# Altium project PIC32ETH.PrjPcb (part 2 of 2)

## Sheet PIC32ETH_Usb.SchDoc: Usb
size A4; Date: 08.01.2022; DrawnBy: YS; DocumentNumber: n/a; Revision: v1.0.0; SheetNumber: 4; SheetTotal: 6; Project: PIC32ETH
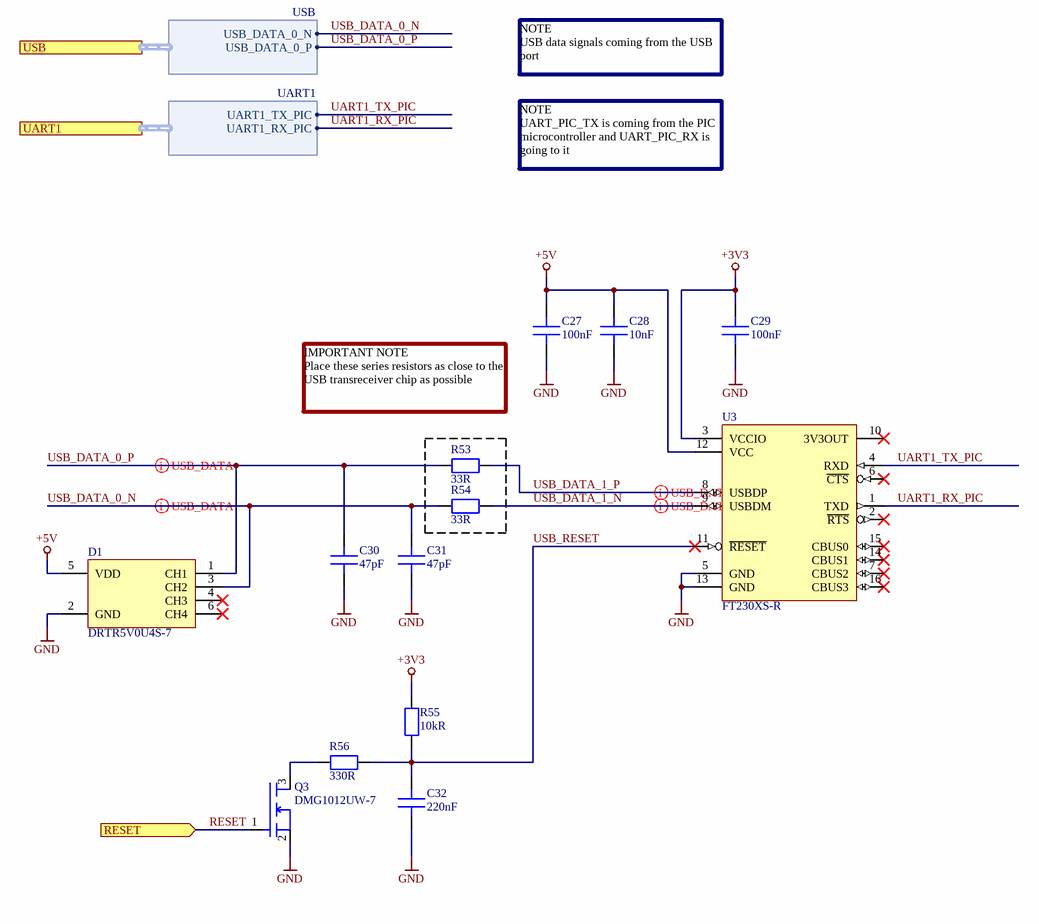
[diagram p6: PIC32ETH_Usb.SchDoc]

### Parts
C27  100nF  [C_CHIP2012N]
C28  10nF  [C_CHIP2012N]
C29  100nF  [C_CHIP2012N]
C30  47pF  [C_CHIP2012N]
C31  47pF  [C_CHIP2012N]
C32  220nF  [C_CHIP2012N]
D1  DRTR5V0U4S-7  [D_SOT65P210X100-6N]
Q3  DMG1012UW-7  [Q_SOT65P210X100-3N]
R53  33R  [R_CHIP2012N]
R54  33R  [R_CHIP2012N]
R55  10kR  [R_CHIP2012N]
R56  330R  [R_CHIP2012N]
U3  FT230XS-R  [U_TSOP64P600X135-16N]

### Ports
RESET (in), UART1 (harness UART1), USB (harness USB)

### Harnesses
USB: USB_DATA_0_P, USB_DATA_0_N
UART1: UART1_RX_PIC, UART1_TX_PIC

### Nets
+3V3: C29.1 R55.2 U3.3(VCCIO)
+5V: C27.1 C28.2 D1.5(VDD) U3.12(VCC)
GND: C27.2 C28.1 C29.2 C30.1 C31.1 C32.1 D1.2(GND) Q3.2(S) U3.5(GND) U3.13(GND)
RESET: Q3.1(G) ; port RESET
UART1_RX_PIC: U3.1(TXD) ; port UART1.UART1_RX_PIC
UART1_TX_PIC: U3.4(RXD) ; port UART1.UART1_TX_PIC
USB_DATA_0_N: C31.2 D1.3(CH2) R54.1 ; port USB.USB_DATA_0_N
USB_DATA_0_P: C30.2 D1.1(CH1) R53.1 ; port USB.USB_DATA_0_P
USB_DATA_1_N: R54.2 U3.9(USBDM)
USB_DATA_1_P: R53.2 U3.8(USBDP)
USB_RESET: C32.2 R55.1 R56.2 U3.11(~{RESET})
NetQ3_3: Q3.3(D) R56.1

Not connected (* = marked no-connect by the designer): D1 4(CH3)* 6(CH4)*; U3 2(~{RTS})* 6(~{CTS})* 7(CBUS2)* 10(3V3OUT)* 14(CBUS1)* 15(CBUS0)* 16(CBUS3)*

### Layout directives
differential pair; differential pair class USB_DATA: USB_DATA_0_N, USB_DATA_0_P, USB_DATA_1_N, USB_DATA_1_P

### Notes on the sheet
- NOTE
  USB data signals coming from the USB port
- NOTE
  UART_PIC_TX is coming from the PIC microcontroller and UART_PIC_RX is going to it
- IMPORTANT NOTE
  Place these series resistors as close to the USB transreceiver chip as possible
- Project:
- Doc Nr:
- File:
- Drawn:
- Rev:
- Date:
- Size:
- Sheet:
- A4
- of

### Library data of the parts
C27 C29 = C_C0805C104K5RACTU: C CERAMIC 100nF 50V 10% 2012; Manufacturer: Kemet; Dielectric: X7R; Tolerance: +/-10%; Datasheet Url: https://content.kemet.com/datasheets/KEM_C1002_X7R_SMD.pdf; Mounting: SMT; Package: 2012; Part Number: C0805C104K5RACTU; Price: 0.23; Price Currency: CHF; Supplier 1: Digi-Key; Capacitance: 100nF; Voltage: 50V; Supplier Part Number 1: 399-1170-1-ND; Esr: n/a; Pin Count: 2; Temperature Range: -55degC to 125degC
C28 = C_C0805C103K5RACTU: C CERAMIC 10nF 50V 10% 2012; Manufacturer: Kemet; Dielectric: X7R; Tolerance: +/-10%; Datasheet Url: https://content.kemet.com/datasheets/KEM_C1002_X7R_SMD.pdf; Mounting: SMT; Package: 2012; Part Number: C0805C103K5RACTU; Price: 0.18; Price Currency: CHF; Supplier 1: Digi-Key; Capacitance: 10nF; Voltage: 50V; Supplier Part Number 1: 399-1158-1-ND; Esr: n/a; Pin Count: 2; Temperature Range: -55degC to 125degC
C30 C31 = C_C0805C470K5GACTU: C CERAMIC 47pF 50V 10% 2012; Manufacturer: Kemet; Dielectric: C0G; Tolerance: +/-10%; Datasheet Url: https://api.kemet.com/component-edge/download/datasheet/C0805C470K5GACTU.pdf; Mounting: SMT; Package: 2012; Part Number: C0805C470K5GACTU; Price: 0.11; Price Currency: CHF; Supplier 1: Digi-Key; Capacitance: 47pF; Voltage: 50V; Supplier Part Number 1: 399-8081-1-ND; Esr: n/a; Pin Count: 2; Temperature Range: -55degC to 125degC
C32 = C_C0805C224K5RACTU: C CERAMIC 220nF 50V 10% 2012; Manufacturer: Kemet; Dielectric: X7R; Tolerance: +/-10%; Datasheet Url: https://content.kemet.com/datasheets/KEM_C1002_X7R_SMD.pdf; Mounting: SMT; Package: 2012; Part Number: C0805C224K5RACTU; Price: 0.16; Price Currency: CHF; Supplier 1: Digi-Key; Capacitance: 220nF; Voltage: 50V; Supplier Part Number 1: 399-3491-1-ND; Esr: n/a; Pin Count: 2; Temperature Range: -55degC to 125degC
D1 = D_DRTR5V0U4S-7: D TVS 5.5V 6V 200mW SOT-363; Manufacturer: Diodes Incorporated; Datasheet URL: https://www.diodes.com/assets/Datasheets/DRTR5V0U4S.pdf; Mounting: SMT; Package: SOT-363; Part Number: DRTR5V0U4S-7; Price: 0.39; Price Currency: CHF; Supplier 1: Digi-Key; Supplier Part Number 1: DRTR5V0U4S-7DICT-ND; Temperature Range: -65degC to 150degC; Pin Count: 6; Power: 200mW; Voltage Breakdown: 6V; Voltage Reverse Standoff: 5.5V
Q3 = Q_DMG1012UW-7: Q MOSFET N-CH 20V 1A SOT-323; Manufacturer: Diodes Incorporated; Power: 290mW; Voltage Gate Source: +/-6V; Datasheet Url: https://www.diodes.com/assets/Datasheets/ds31859.pdf; Mounting: SMT; Package: SOT-323; Part Number: DMG1012UW-7; Price: 0.39; Price Currency: CHF; Supplier 1: Digi-Key; Supplier Part Number 1: DMG1012UW-7DICT-ND; Current Drain: 1A; Pin Count: 3; Temperature Range: -55degC to 150degC; Voltage Drain Source: 20V; Mosfet Type: N-CH
R53 R54 = R_RMCF0805FT33R0: R SMT 33R 1% 125mW 2012; Manufacturer: Stackpole Electronics Inc; Temperature Coefficient: 100ppm/degC; Tolerance: +/-1%; Voltage: 150V; Datasheet Url: https://www.seielect.com/catalog/sei-rmcf_rmcp.pdf; Mounting: SMT; Package: 2012; Part Number: RMCF0805FT33R0; Price: 0.10; Price Currency: CHF; Supplier 1: Digi-Key; Resistance: 33R; Supplier Part Number 1: RMCF0805FT33R0CT-ND; Temperature Range: -55degC to 155degC; Pin Count: 2; Power: 125mW
R55 = R_RMCF0805FT10K0: R SMT 10kR 1% 125mW 2012; Manufacturer: Stackpole Electronics Inc; Temperature Coefficient: 100ppm/degC; Tolerance: +/-1%; Voltage: 150V; Datasheet Url: https://www.seielect.com/catalog/sei-rmcf_rmcp.pdf; Mounting: SMT; Package: 2012; Part Number: RMCF0805FT10K0; Price: 0.10; Price Currency: CHF; Supplier 1: Digi-Key; Resistance: 10kR; Power: 125mW; Supplier Part Number 1: RMCF0805FT10K0CT-ND; Pin Count: 2; Temperature Range: -55degC to 155degC
R56 = R_RMCF0805FT330R: R SMT 330R 1% 125mW 2012; Manufacturer: Stackpole Electronics Inc; Temperature Coefficient: 100ppm/degC; Tolerance: +/-1%; Voltage: 150V; Datasheet Url: https://www.seielect.com/catalog/sei-rmcf_rmcp.pdf; Mounting: SMT; Package: 2012; Part Number: RMCF0805FT330R; Price: 0.10; Price Currency: CHF; Supplier 1: Digi-Key; Resistance: 330R; Supplier Part Number 1: RMCF0805FT330RCT-ND; Temperature Range: -55degC to 155degC; Pin Count: 2; Power: 125mW
U3 = U_FT230XS-R: U TRANSCEIVER UART-USB 16-SSOP; Manufacturer: FTDI; Voltage Input: 3.3V to 5V; Datasheet Url: http://www.ftdichip.com/Support/Documents/DataSheets/ICs/DS_FT230X.pdf; Mounting: SMT; Package: 16-SSOP; Part Number: FT230XS-R; Price: 2.02; Price Currency: CHF; Supplier 1: Digi-Key; Pin Count: 16; Supplier Part Number 1: 768-1135-1-ND; Temperature Range: -40degC to 85degC; Transceiver Type: UART-USB

## Nets that join several sheets
+3V3: PIC32ETH (C49.1 H1.5 H5.1 H6.1), PIC32ETH_Pic (32 pins), PIC32ETH_Ethernet (FB2.1), PIC32ETH_Peripheral (S2.4 S3.4), PIC32ETH_Power (6 pins), PIC32ETH_Usb (C29.1 R55.2 U3.3)
+3V3_ETH_VDDIO: PIC32ETH (H2.12), PIC32ETH_Ethernet (11 pins)
+5V: PIC32ETH_Power (6 pins), PIC32ETH_Usb (C27.1 C28.2 D1.5 U3.12)
GND: PIC32ETH (11 pins), PIC32ETH_Pic (30 pins), PIC32ETH_Ethernet (21 pins), PIC32ETH_Peripheral (6 pins), PIC32ETH_Power (20 pins), PIC32ETH_Usb (10 pins)
CLK_50MHz_ETH: PIC32ETH_Pic (R26.2), PIC32ETH_Ethernet (U2.30)
ETH_CRSDV_1: PIC32ETH_Pic (U1.101), PIC32ETH_Ethernet (R51.1)
ETH_LED_ACT: PIC32ETH (H2.11), PIC32ETH_Ethernet (R33.1)
ETH_LED_LINK: PIC32ETH (H2.1), PIC32ETH_Ethernet (R34.1)
ETH_MDC: PIC32ETH_Pic (U1.99), PIC32ETH_Ethernet (U2.13)
ETH_MDIO: PIC32ETH_Pic (U1.115), PIC32ETH_Ethernet (R31.1 U2.12)
ETH_RX_N: PIC32ETH (H2.8), PIC32ETH_Ethernet (R38.2 U2.2)
ETH_RX_P: PIC32ETH (H2.7), PIC32ETH_Ethernet (R37.2 U2.1)
ETH_RXD0_1: PIC32ETH_Pic (U1.81), PIC32ETH_Ethernet (R45.1)
ETH_RXD1_1: PIC32ETH_Pic (U1.66), PIC32ETH_Ethernet (R50.1)
ETH_RXER_1: PIC32ETH_Pic (U1.65), PIC32ETH_Ethernet (R52.1)
ETH_TX_N: PIC32ETH (H2.4), PIC32ETH_Ethernet (R36.2 U2.5)
ETH_TX_P: PIC32ETH (H2.3), PIC32ETH_Ethernet (R35.2 U2.6)
ETH_TXD0_0: PIC32ETH_Pic (U1.7), PIC32ETH_Ethernet (R40.1)
ETH_TXD1_0: PIC32ETH_Pic (U1.8), PIC32ETH_Ethernet (R41.1)
ETH_TXEN_0: PIC32ETH_Pic (U1.120), PIC32ETH_Ethernet (R42.1)
GPIO_RE0: PIC32ETH (H6.3), PIC32ETH_Pic (R8.1)
GPIO_RE1: PIC32ETH (H6.4), PIC32ETH_Pic (R9.1)
GPIO_RE2: PIC32ETH (H6.5), PIC32ETH_Pic (R10.1)
GPIO_RE3: PIC32ETH (H6.6), PIC32ETH_Pic (R11.1)
GPIO_RE4: PIC32ETH (H6.7), PIC32ETH_Pic (R12.1)
GPIO_RE5: PIC32ETH (H6.8), PIC32ETH_Pic (R13.1)
GPIO_RE6: PIC32ETH (H6.9), PIC32ETH_Pic (R14.1)
GPIO_RE7: PIC32ETH (H6.10), PIC32ETH_Pic (R15.1)
HEADER_V_IN: PIC32ETH (H4.1), PIC32ETH_Power (C36.2 FB3.1)
I2C1_SCL_1: PIC32ETH (H5.5), PIC32ETH_Pic (R4.1)
I2C1_SDA_1: PIC32ETH (H5.6), PIC32ETH_Pic (R5.1)
ICSP1_PGE_CLK: PIC32ETH (H1.2), PIC32ETH_Pic (U1.35)
ICSP1_PGE_DATA: PIC32ETH (H1.3), PIC32ETH_Pic (U1.36)
ICSP_MCLR: PIC32ETH (H1.6), PIC32ETH_Pic (R21.1 U1.20)
PER_BTN0: PIC32ETH_Pic (U1.23), PIC32ETH_Peripheral (C33.1 R59.1)
PER_BTN1: PIC32ETH_Pic (U1.24), PIC32ETH_Peripheral (C34.1 R60.1)
PER_LED0: PIC32ETH_Pic (U1.26), PIC32ETH_Peripheral (R57.1)
PER_LED1: PIC32ETH_Pic (U1.25), PIC32ETH_Peripheral (R58.1)
RESET: PIC32ETH_Pic (C1.1 Q1.1 R18.1), PIC32ETH_Ethernet (Q2.1), PIC32ETH_Usb (Q3.1)
SPI1_MISO_1: PIC32ETH (H5.9), PIC32ETH_Pic (R3.1)
SPI1_MOSI_1: PIC32ETH (H5.8), PIC32ETH_Pic (R2.1)
SPI1_SCK_1: PIC32ETH (H5.7), PIC32ETH_Pic (R1.1)
UART1_RX_PIC: PIC32ETH_Pic (U1.90), PIC32ETH_Usb (U3.1)
UART1_TX_PIC: PIC32ETH_Pic (U1.91), PIC32ETH_Usb (U3.4)
UART2_RX_PIC_1: PIC32ETH (H5.4), PIC32ETH_Pic (R7.1)
UART2_TX_PIC_1: PIC32ETH (H5.3), PIC32ETH_Pic (R6.1)
USB_+5V_IN: PIC32ETH (H3.1), PIC32ETH_Power (C47.2 FB4.1)
USB_DATA_0_N: PIC32ETH (H3.2), PIC32ETH_Usb (C31.2 D1.3 R54.1)
USB_DATA_0_P: PIC32ETH (H3.3), PIC32ETH_Usb (C30.2 D1.1 R53.1)